# EAGLE design rf_spectrum (EAGLE 8.2.0)
AUTHOR: Joshua Adkins; REV: A; TITLE: RF Spectrum Module

## Sheet 1 of 2: MCU, powersupply, module header
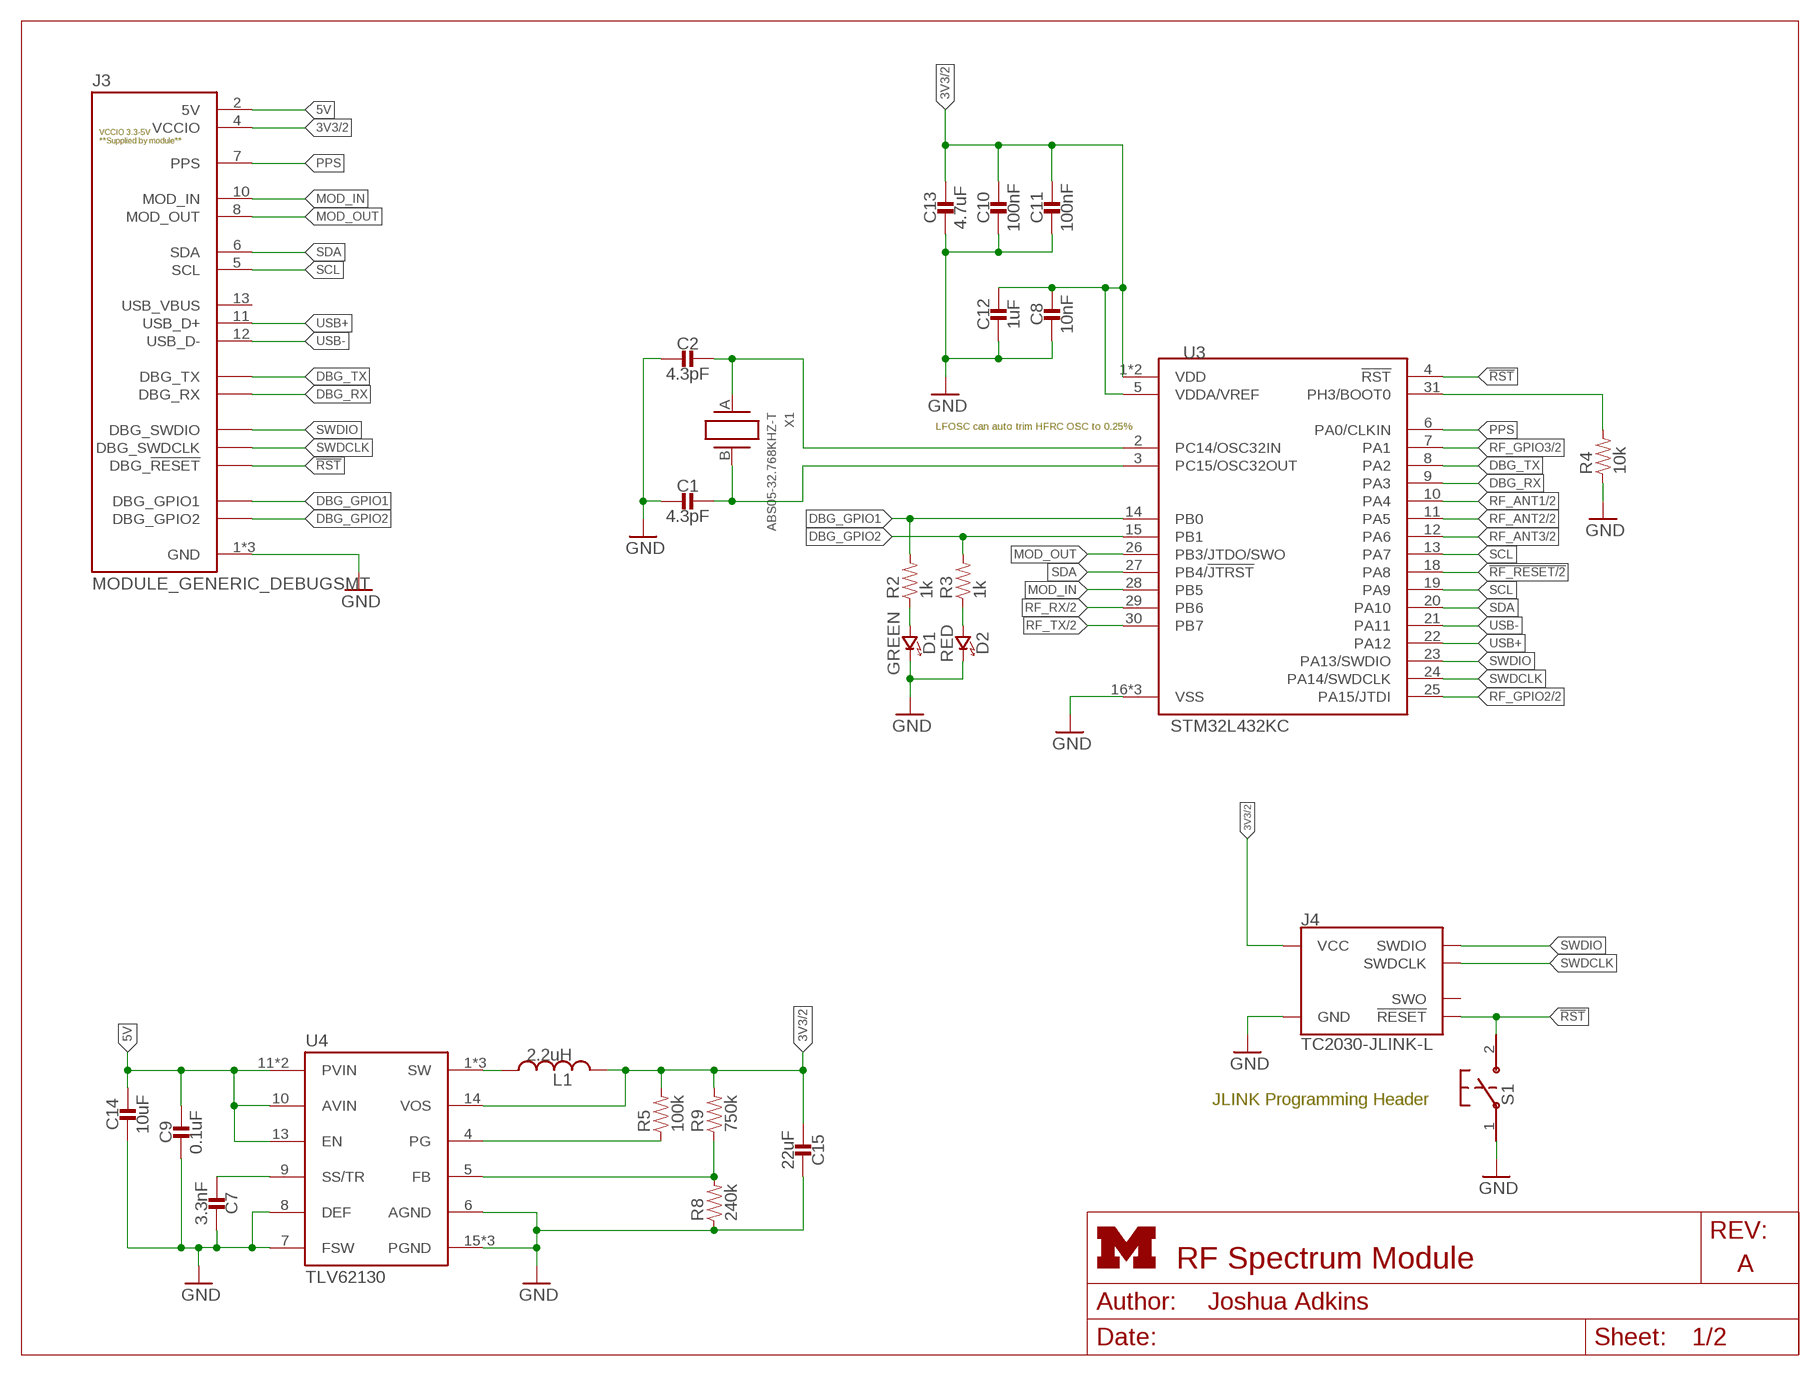
[diagram p0: schematic, sheet 1]
FRAME1 (LETTER_L_UMICH): HEIGHT: 8.5in; WIDTH: 11in

### Parts
C1  4.3pF  CAPACITOR0402_CAP  [0402_CAP]
C2  4.3pF  CAPACITOR0402_CAP  [0402_CAP]
C7  3.3nF  CAPACITOR0603_CAP  [0603_CAP]
C8  10nF  CAPACITOR0402_CAP  [0402_CAP]
C9  0.1uF  CAPACITOR0603_CAP  [0603_CAP]
C10  100nF  CAPACITOR0402_CAP  [0402_CAP]
C11  100nF  CAPACITOR0402_CAP  [0402_CAP]
C12  1uF  CAPACITOR0402_CAP  [0402_CAP]
C13  4.7uF  CAPACITOR0402_CAP  [0402_CAP]
C14  10uF  CAPACITOR0603_CAP  [0603_CAP]
C15  22uF  CAPACITOR0603_CAP  [0603_CAP]
D1  GREEN  LED0603  [LED-0603]
D2  RED  LED0603  [LED-0603]
J3  MODULE_GENERIC_DEBUGSMT  [MODULE_GENERIC_DEBUG_SMT]
J4  TC2030-JLINK-L  [TC2030-IDC]
L1  2.2uH  INDUCTORIHL  [IHL-1212BZ-11]
R2  1k  RESISTOR0402_RES  [0402_RES]
R3  1k  RESISTOR0402_RES  [0402_RES]
R4  10k  RESISTOR0402_RES  [0402_RES]
R5  100k  RESISTOR0603_RES  [0603-RES]
R8  240k  RESISTOR0603_RES  [0603-RES]
R9  750k  RESISTOR0603_RES  [0603-RES]
S1  B3U-1000P  [B3U-1000P]
U3  STM32L432KC  [UQFN-32]
U4  TLV62130  [TQFN-16/3MM]
X1  ABS05-32.768KHZ-T  [ABS05]

### Nets
3V3: C8.1 C10.1 C11.1 C12.1 C13.1 C15.2 J3.4(VCCIO) J4.1(VCC) L1.P$2 R5.2 R9.2 U3.1(VDD) U3.5(VDDA/VREF) U3.17(VDD) U4.14(VOS) ; also sheet 2
3VSWOUT: L1.P$1 U4.1(SW) U4.2(SW) U4.3(SW)
5V: C9.1 C14.1 J3.2(5V) U4.10(AVIN) U4.11(PVIN) U4.12(PVIN) U4.13(EN)
!RF_RESET: U3.18(PA8) ; also sheet 2
!RST: J3.20(DBG_!RESET) J4.3(!RESET) S1.2 U3.4(!RST)
DBG_GPIO1: J3.16(DBG_GPIO1) R2.2 U3.14(PB0)
DBG_GPIO2: J3.19(DBG_GPIO2) R3.2 U3.15(PB1)
DBG_RX: J3.18(DBG_RX) U3.9(PA3)
DBG_TX: J3.17(DBG_TX) U3.8(PA2)
GND: C1.2 C2.2 C7.1 C8.2 C9.2 C10.2 C11.2 C12.2 C13.2 C14.2 C15.1 D1.C(CATHODE) D2.C(CATHODE) J3.1(GND) J3.14(GND) J3.15(GND) J4.5(GND) R4.1 R8.1 S1.1 U3.16(VSS) U3.32(VSS) U3.THERMAL(VSS) U4.6(AGND) U4.7(FSW) U4.8(DEF) U4.15(PGND) U4.16(PGND) U4.GND ; also sheet 2
MOD_IN: J3.10(MOD_IN) U3.28(PB5)
MOD_OUT: J3.8(MOD_OUT) U3.26(PB3/JTDO/SWO)
N$9: C2.1 U3.2(PC14/OSC32IN) X1.A
N$10: C1.1 U3.3(PC15/OSC32OUT) X1.B
N$11: R4.2 U3.31(PH3/BOOT0)
N$12: D1.A(ANODE) R2.1
N$34: C7.2 U4.9(SS/TR)
N$36: R5.1 U4.4(PG)
N$37: R8.2 R9.1 U4.5(FB)
PPS: J3.7(PPS) U3.6(PA0/CLKIN)
R3: D2.A(ANODE) R3.1
RF_ANT1: U3.10(PA4) ; also sheet 2
RF_ANT2: U3.11(PA5) ; also sheet 2
RF_ANT3: U3.12(PA6) ; also sheet 2
RF_GPIO2: U3.25(PA15/JTDI) ; also sheet 2
RF_GPIO3: U3.7(PA1) ; also sheet 2
RF_RX: U3.29(PB6) ; also sheet 2
RF_TX: U3.30(PB7) ; also sheet 2
SCL: J3.5(SCL) U3.13(PA7) U3.19(PA9)
SDA: J3.6(SDA) U3.20(PA10) U3.27(PB4/!JTRST)
SWDCLK: J3.21(DBG_SWDCLK) J4.4(SWDCLK) U3.24(PA14/SWDCLK)
SWDIO: J3.22(DBG_SWDIO) J4.2(SWDIO) U3.23(PA13/SWDIO)
USB+: J3.11(USB_D+) U3.22(PA12)
USB-: J3.12(USB_D-) U3.21(PA11)
Unconnected: J3.13(USB_VBUS) J4.6(SWO)

### Notes on the sheet
- LFOSC can auto trim HFRC OSC to 0.25%
- JLINK Programming Header

## Sheet 2 of 2: RF spectrum and switch
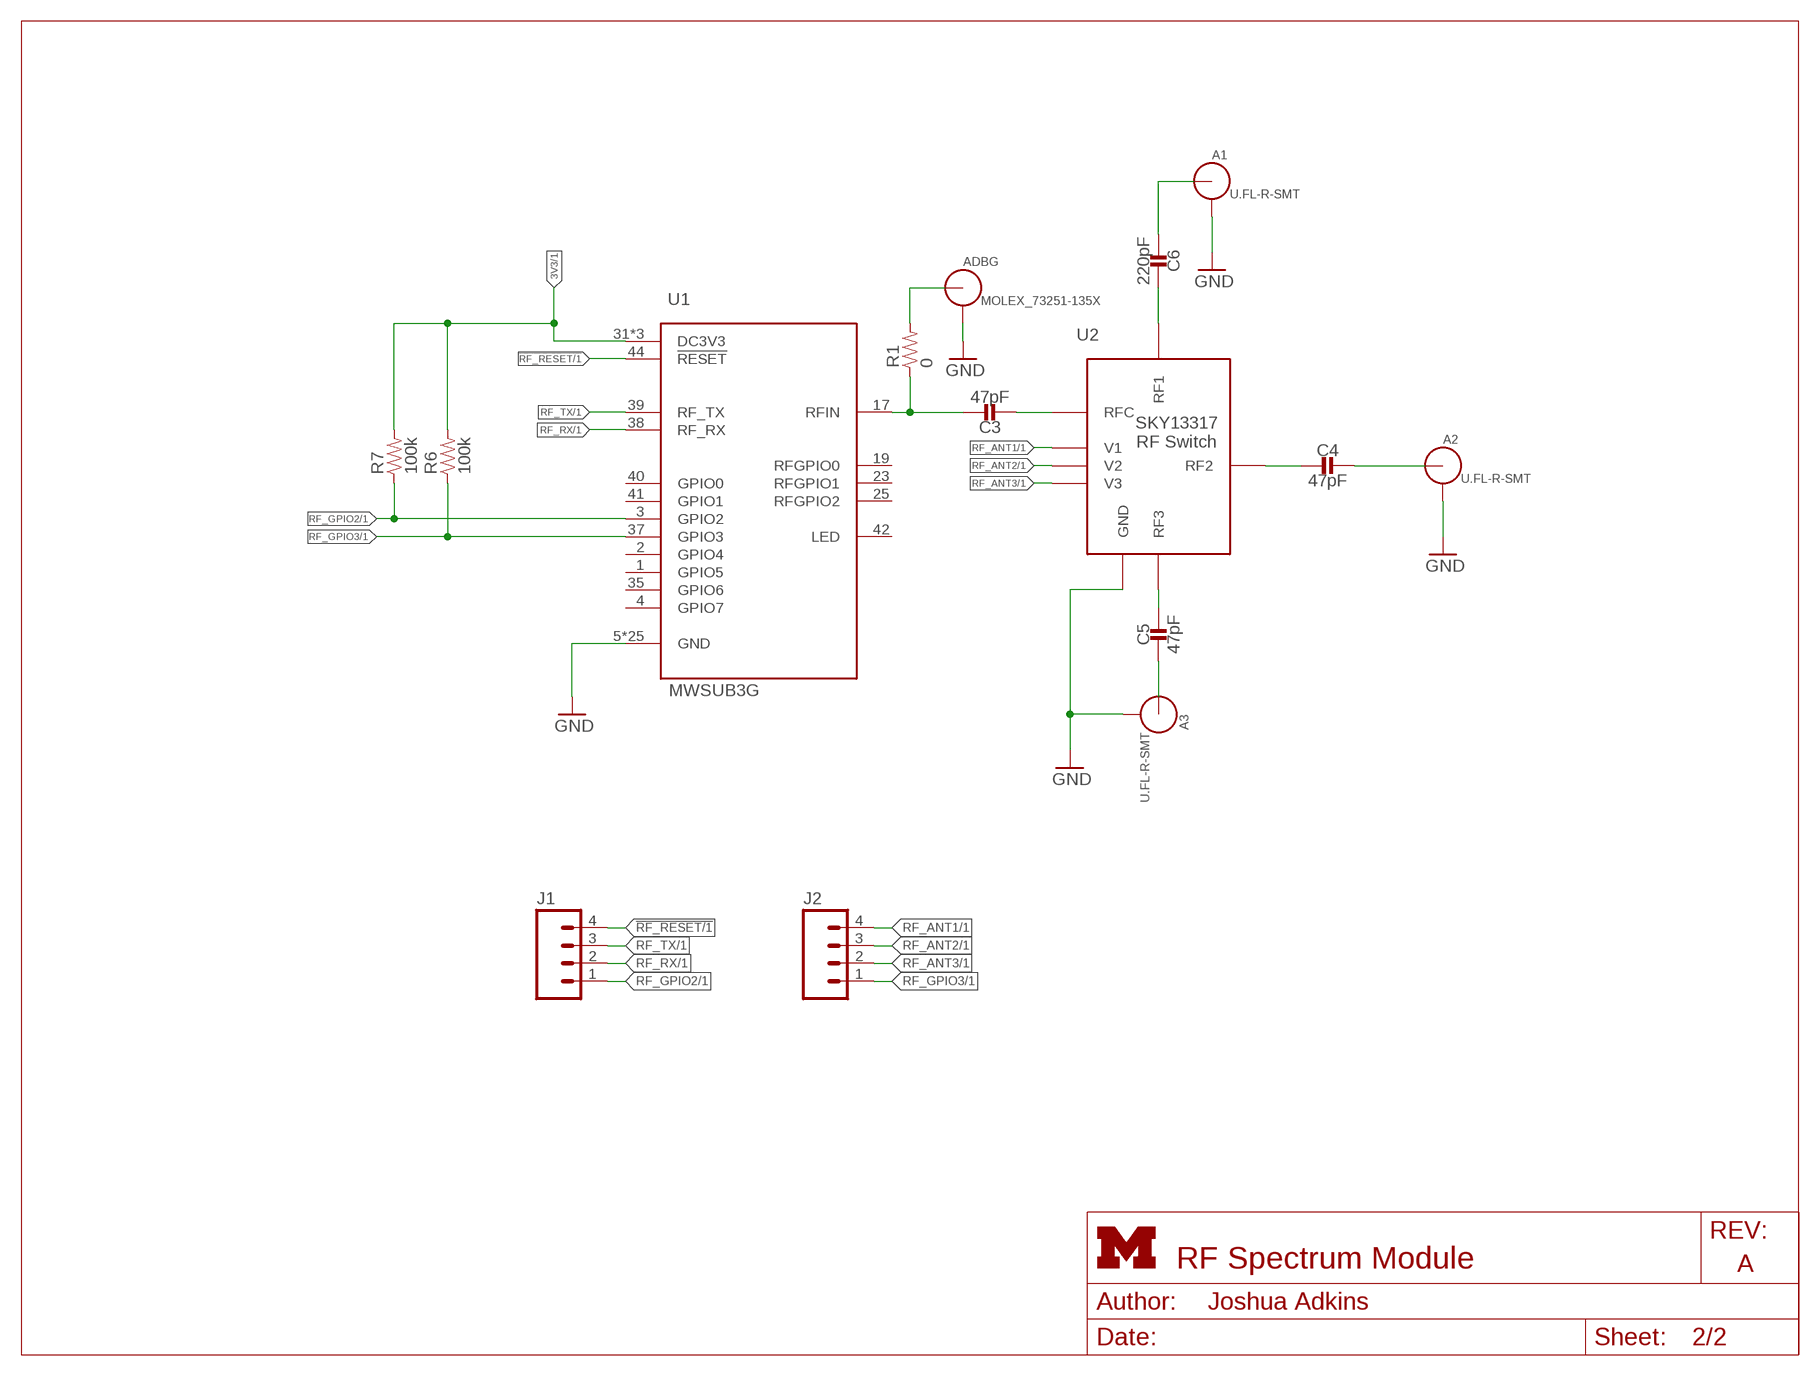
[diagram p1: schematic, sheet 2]
FRAME2 (LETTER_L_UMICH): HEIGHT: 8.5in; WIDTH: 11in

### Parts
A1  U.FL-R-SMT  [U.FL_SMT]
A2  U.FL-R-SMT  [U.FL_SMT]
A3  U.FL-R-SMT  [U.FL_SMT]
ADBG  MOLEX_73251-135X  [SMA-J/PCB]
C3  47pF  CAPACITOR0402_CAP  [0402_CAP]
C4  47pF  CAPACITOR0402_CAP  [0402_CAP]
C5  47pF  CAPACITOR0402_CAP  [0402_CAP]
C6  220pF  CAPACITOR0402_CAP  [0402_CAP]
J1  M04PTH  [1X04]
J2  M04PTH  [1X04]
R1  0  RESISTOR0402_RES  [0402_RES]
R6  100k  RESISTOR0402_RES  [0402_RES]
R7  100k  RESISTOR0402_RES  [0402_RES]
U1  MWSUB3G  [MWSUB3G]
U2  SKY13317  [XDFN-8]

### Nets
3V3: R6.2 R7.2 U1.31(DC3V3) U1.32(DC3V3) U1.33(DC3V3) ; also sheet 1
!RF_RESET: J1.4 U1.44(!RESET) ; also sheet 1
GND: A1.GND1 A1.GND2 A2.GND1 A2.GND2 A3.GND1 A3.GND2 ADBG.2 ADBG.3 ADBG.4 ADBG.5 U1.5(GND) U1.6(GND) U1.7(GND) U1.8(GND) U1.9(GND) U1.10(GND) U1.11(GND) U1.12(GND) U1.13(GND) U1.14(GND) U1.15(GND) U1.16(GND) U1.18(GND) U1.20(GND) U1.21(GND) U1.22(GND) U1.24(GND) U1.26(GND) U1.27(GND) U1.28(GND) U1.29(GND) U1.34(GND) U1.43(GND) U1.45(GND) U1.46(GND) U2.P$1(GND) ; also sheet 1
N$1: C3.1 R1.1 U1.17(RFIN)
N$2: C3.2 U2.1(RFC)
N$3: C6.1 U2.4(RF1)
N$4: A1.SIG(ANT) C6.2
N$5: C4.2 U2.5(RF2)
N$6: A2.SIG(ANT) C4.1
N$7: C5.1 U2.8(RF3)
N$8: A3.SIG(ANT) C5.2
N$14: ADBG.1(ANT) R1.2
RF_ANT1: J2.4 U2.3(V1) ; also sheet 1
RF_ANT2: J2.3 U2.6(V2) ; also sheet 1
RF_ANT3: J2.2 U2.7(V3) ; also sheet 1
RF_GPIO2: J1.1 R7.1 U1.3(GPIO2) ; also sheet 1
RF_GPIO3: J2.1 R6.1 U1.37(GPIO3) ; also sheet 1
RF_RX: J1.2 U1.38(RF_RX) ; also sheet 1
RF_TX: J1.3 U1.39(RF_TX) ; also sheet 1
Unconnected: U1.1(GPIO5) U1.2(GPIO4) U1.4(GPIO7) U1.19(RFGPIO0) U1.23(RFGPIO1) U1.25(RFGPIO2) U1.35(GPIO6) U1.40(GPIO0) U1.41(GPIO1) U1.42(LED)

## Library data of the parts
A1-A3 = connector:U.FL-R-SMT: U.FL-R-SMT Antenna Connector; DIGIKEY: H122041-ND
ADBG = connector:MOLEX_73251-135X: SMA JACK SMT 50 OHM; DIGIKEY: WM9357-ND
C1 C2 = passives:CAPACITOR: 0402 Capacitor; DIGIKEY: 490-6243-1-ND; MF: Murata; MFN: GRM1555C1H4R3BA01D
C3-C5 = passives:CAPACITOR: 0402 Capacitor; DIGIKEY: 490-6241-1-ND; MF: Murata; MFN: GRM1555C1H470FA01D
C6 = passives:CAPACITOR: 0402 Capacitor; DIGIKEY: 490-1293-1-ND; MF: Murata; MFN: GRM1555C1H221JA01D
C7 = passives:CAPACITOR: 0402 Capacitor; DIGIKEY: 490-1503-1-ND; MF: Murata; MFN: GRM188R71H332KA01D
C8 = passives:CAPACITOR: 0402 Capacitor; DIGIKEY: 490-4516-1-ND; MF: Murata; MFN: GRM155R71H103KA88D
C9 = passives:CAPACITOR: 0402 Capacitor; DIGIKEY: 490-1532-1-ND; MF: Murata; MFN: GRM188R71C104KA01D
C10 C11 = passives:CAPACITOR: 0402 Capacitor; DIGIKEY: 490-6328-1-ND; MF: Murata; MFN: GRM155R71C104KA88J
C12 = passives:CAPACITOR: 0402 Capacitor; DIGIKEY: 490-1320-1-ND; MF: Murata; MFN: GRM155R60J105KE19D
C13 = passives:CAPACITOR: 0402 Capacitor; DIGIKEY: 490-5915-1-ND; MF: Murata; MFN: GRM155R60J475ME47D
C14 = passives:CAPACITOR: 0402 Capacitor; DIGIKEY: 490-6405-1-ND; MF: Murata; MFN: GRM188R60J106ME47J
C15 = passives:CAPACITOR: 0402 Capacitor; DIGIKEY: 490-7611-1-ND; MF: Murata; MFN: GRM188R60J226MEA0D
D1 = leds:LED: LED; DIGIKEY: 160-1446-1-ND; MF: Lite-ON; MFN: LTST-C191KGKT
D2 = leds:LED: LED; DIGIKEY: 160-1447-1-ND; MF: Lite-On; MFN: LTST-C191KRKT
J1 J2 = SparkFun-Connectors:M04: Header 4 Standard 4-pin 0.1" header. Use with straight break away headers (SKU : PRT-00116), right angle break away headers (PRT-00553), swiss pins (PRT-00743), machine pins (PRT-00117), and female headers (PRT-00115). Molex polarized connector foot print use with SKU : PRT-08231 with associated crimp pins and housings. 1MM SMD Version SKU: PRT-10208; DIGIKEY: WM8086-ND; MF: Molex; MFN: 0901200764
J3 = signpost:MODULE_GENERIC_DEBUG: The debug version of the signpost module header; DIGIKEY1: S9170-ND; DIGIKEY2: WM17450-ND; MF1: Sullins; MF2: Molex; MFN1: SBH11-PBPC-D07-ST-BK; MFN2: 0015912080
J4 = connector:TC2030-JLINK
L1 = passives:INDUCTOR: A very specific inductor; DIGIKEY: 541-1322-1-ND
R1 = passives:RESISTOR: Resistor Basic schematic elements and footprints for 0603, 1206, and PTH resistors.; DIGIKEY: 311-0.0JRCT-ND; MF: Yageo; MFN: RC0402JR-070RL
R2-R4 = passives:RESISTOR: Resistor Basic schematic elements and footprints for 0603, 1206, and PTH resistors.; DIGIKEY: 311-1.0KJRCT-ND; MF: Yageo; MFN: RC0402JR-071KL
R5 = passives:RESISTOR: Resistor Basic schematic elements and footprints for 0603, 1206, and PTH resistors.; DIGIKEY: 311-100KGRCT-ND; MF: Yageo; MFN: RC0603JR-07100KL
R6 R7 = passives:RESISTOR: Resistor Basic schematic elements and footprints for 0603, 1206, and PTH resistors.; DIGIKEY: 311-100KLRCT-ND; MF: Yageo; MFN: RC0402FR-07100KL
R8 = passives:RESISTOR: Resistor Basic schematic elements and footprints for 0603, 1206, and PTH resistors.; DIGIKEY: 311-240KGRCT-ND; MF: Yageo; MFN: RC0603JR-07240KL
R9 = passives:RESISTOR: Resistor Basic schematic elements and footprints for 0603, 1206, and PTH resistors.; DIGIKEY: 311-750KGRCT-ND; MF: Yageo; MFN: 311-750KGRCT-ND
S1 = switches:B3U: Switch; DIGIKEY: SW1020CT-ND
U1 = signpost:MWSUB3G: An RF Spectrum analyzer module; MF: RFExplorer; MFN: MWSUB3G
U2 = chips:SKY13317: 20-6000 MHZ SP3T RF Switch
U3 = chips:STM32L432KC: Simple STM32 Cortex M4. Features include a fast 32bit timer, 2 spi, 2 i2c, 2usart, hardware aes and more.; DIGIKEY: 497-16578-ND; MF: STM; MFN: STM32L432KCU6
U4 = chips:TLV62130: High Efficient 3A switching step-down regulator. 1V-5V out, 4V-17V in.; DIGIKEY: 296-35978-1-ND
X1 = crystals:ABS05-32.768KHZ: 32.768kHz Crystal; DIGIKEY: 535-11899-1-ND

## Board
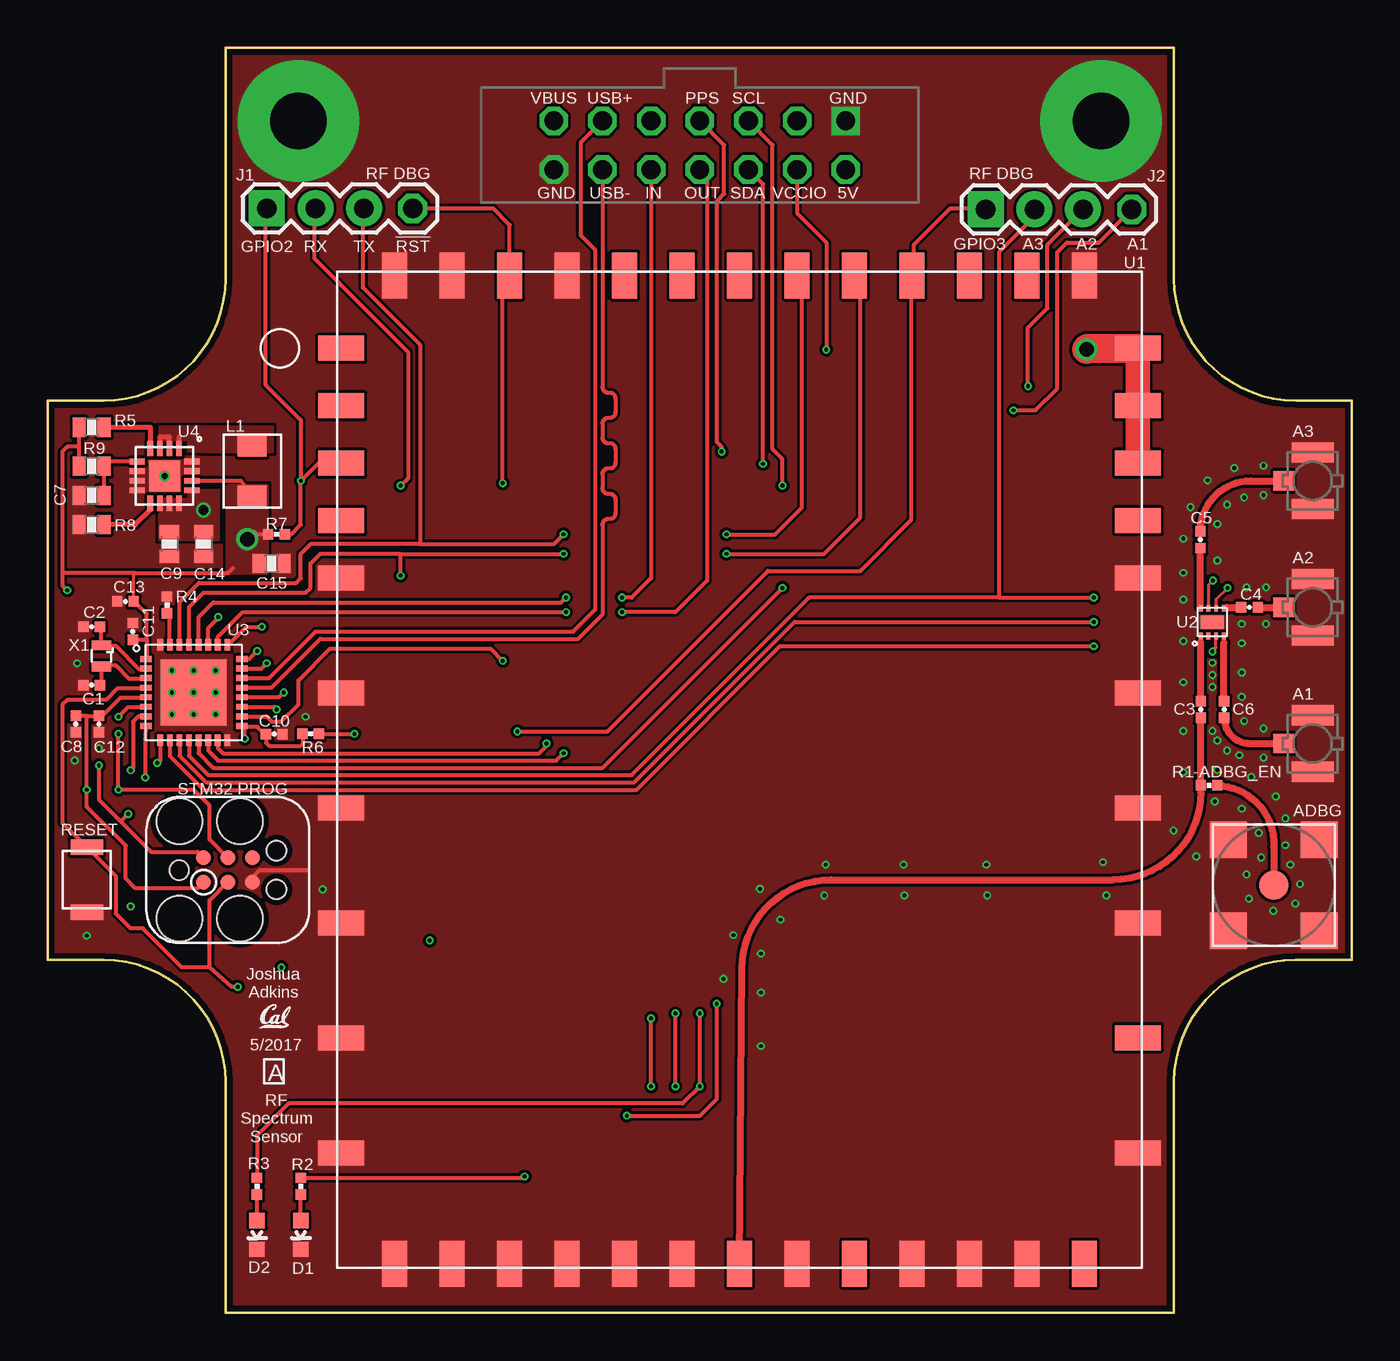
[diagram p2: board, top side]
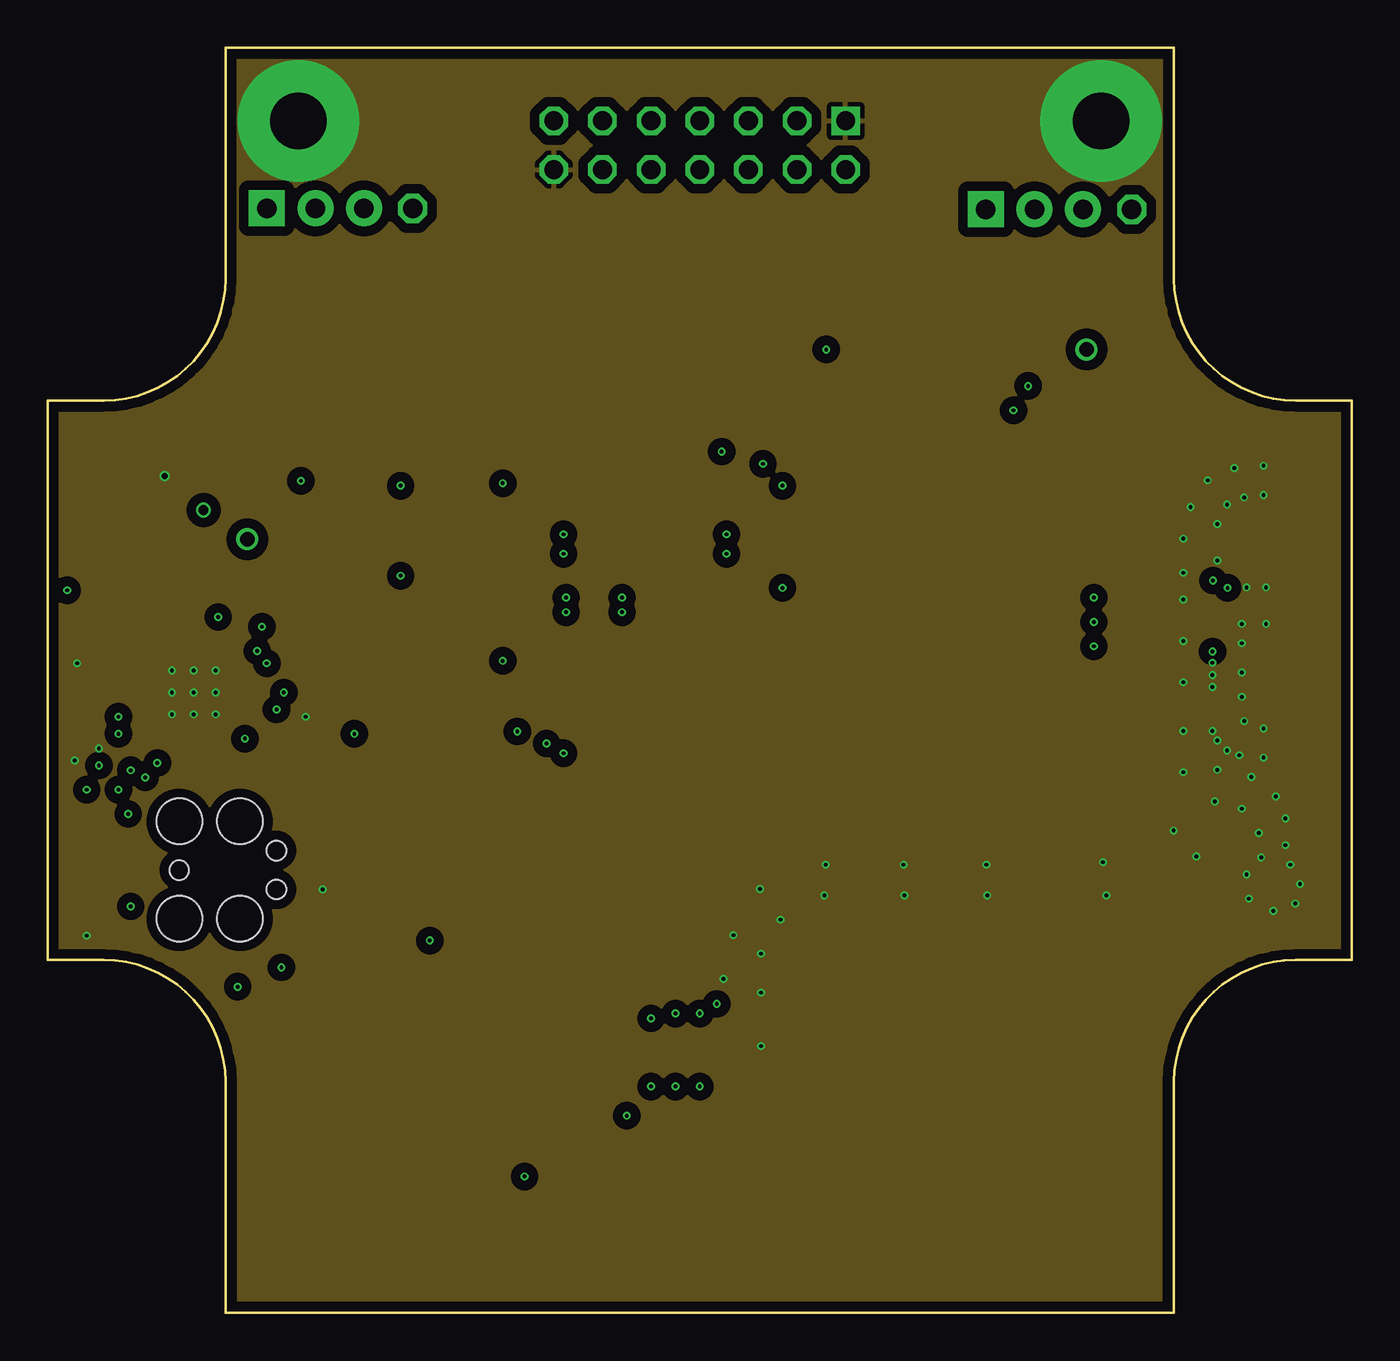
[diagram p3: board, inner layer Route2]
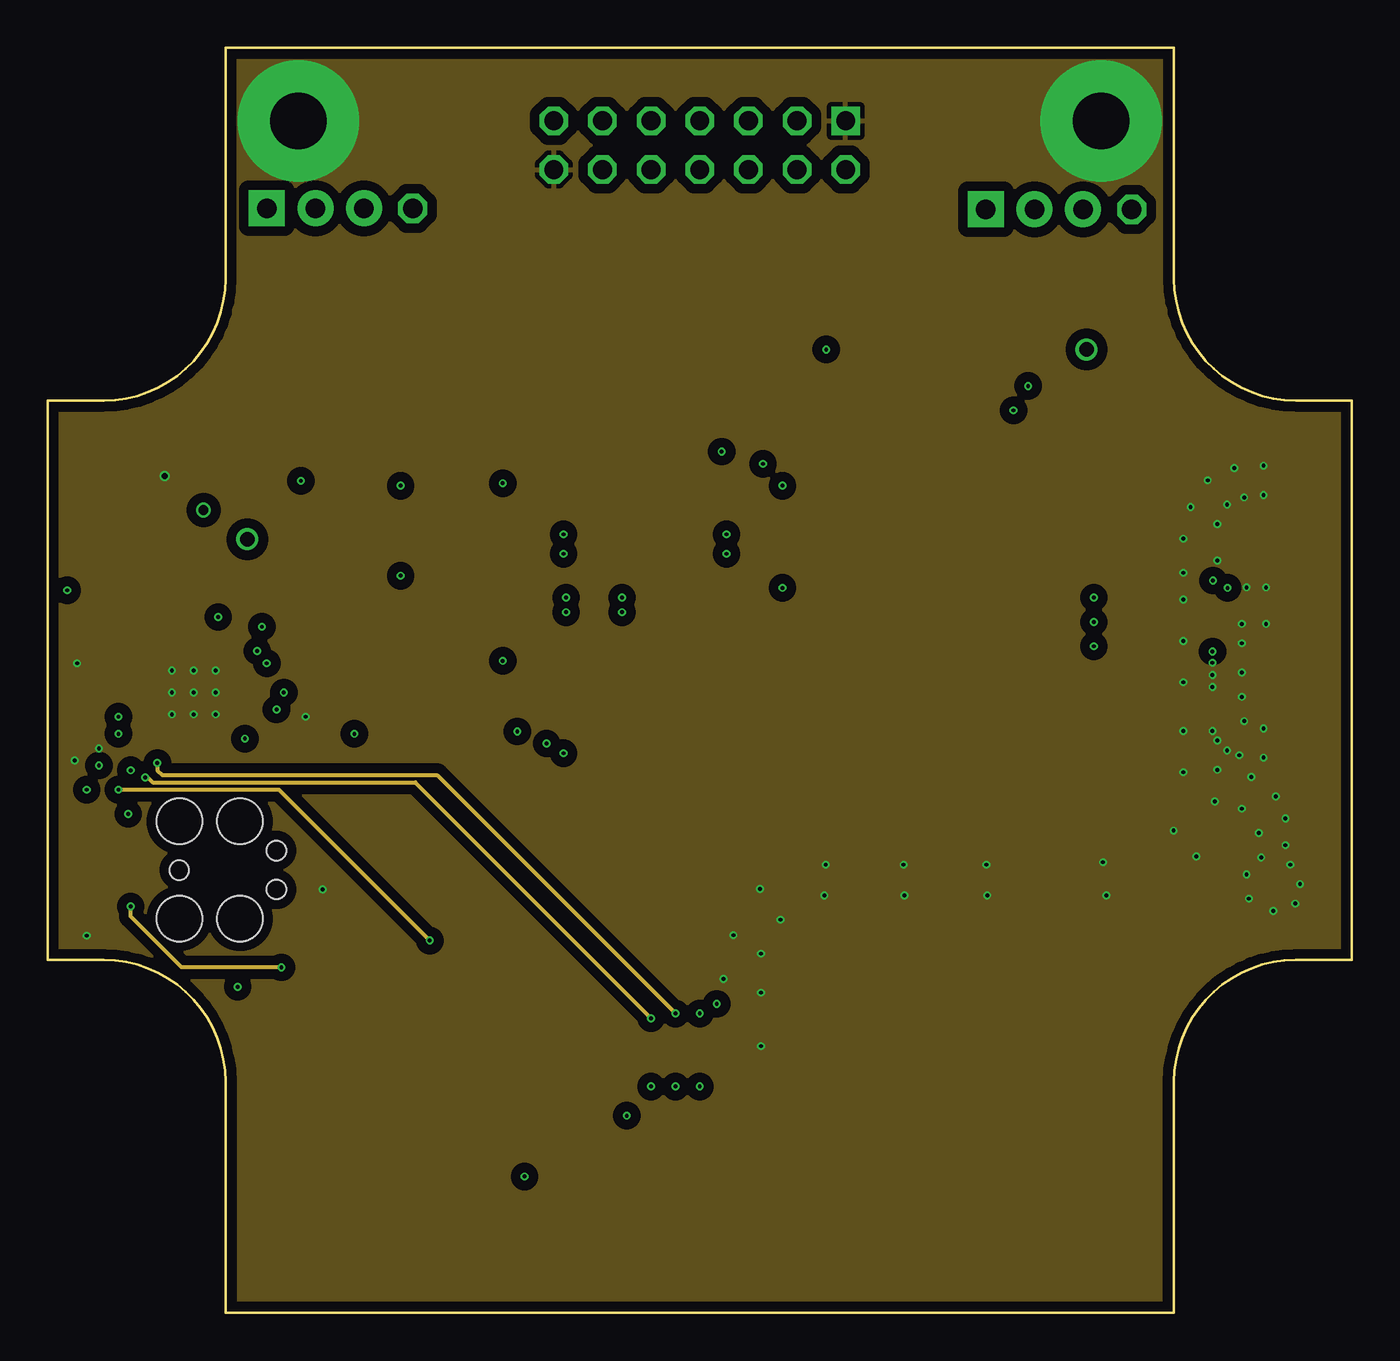
[diagram p4: board, inner layer Route15]
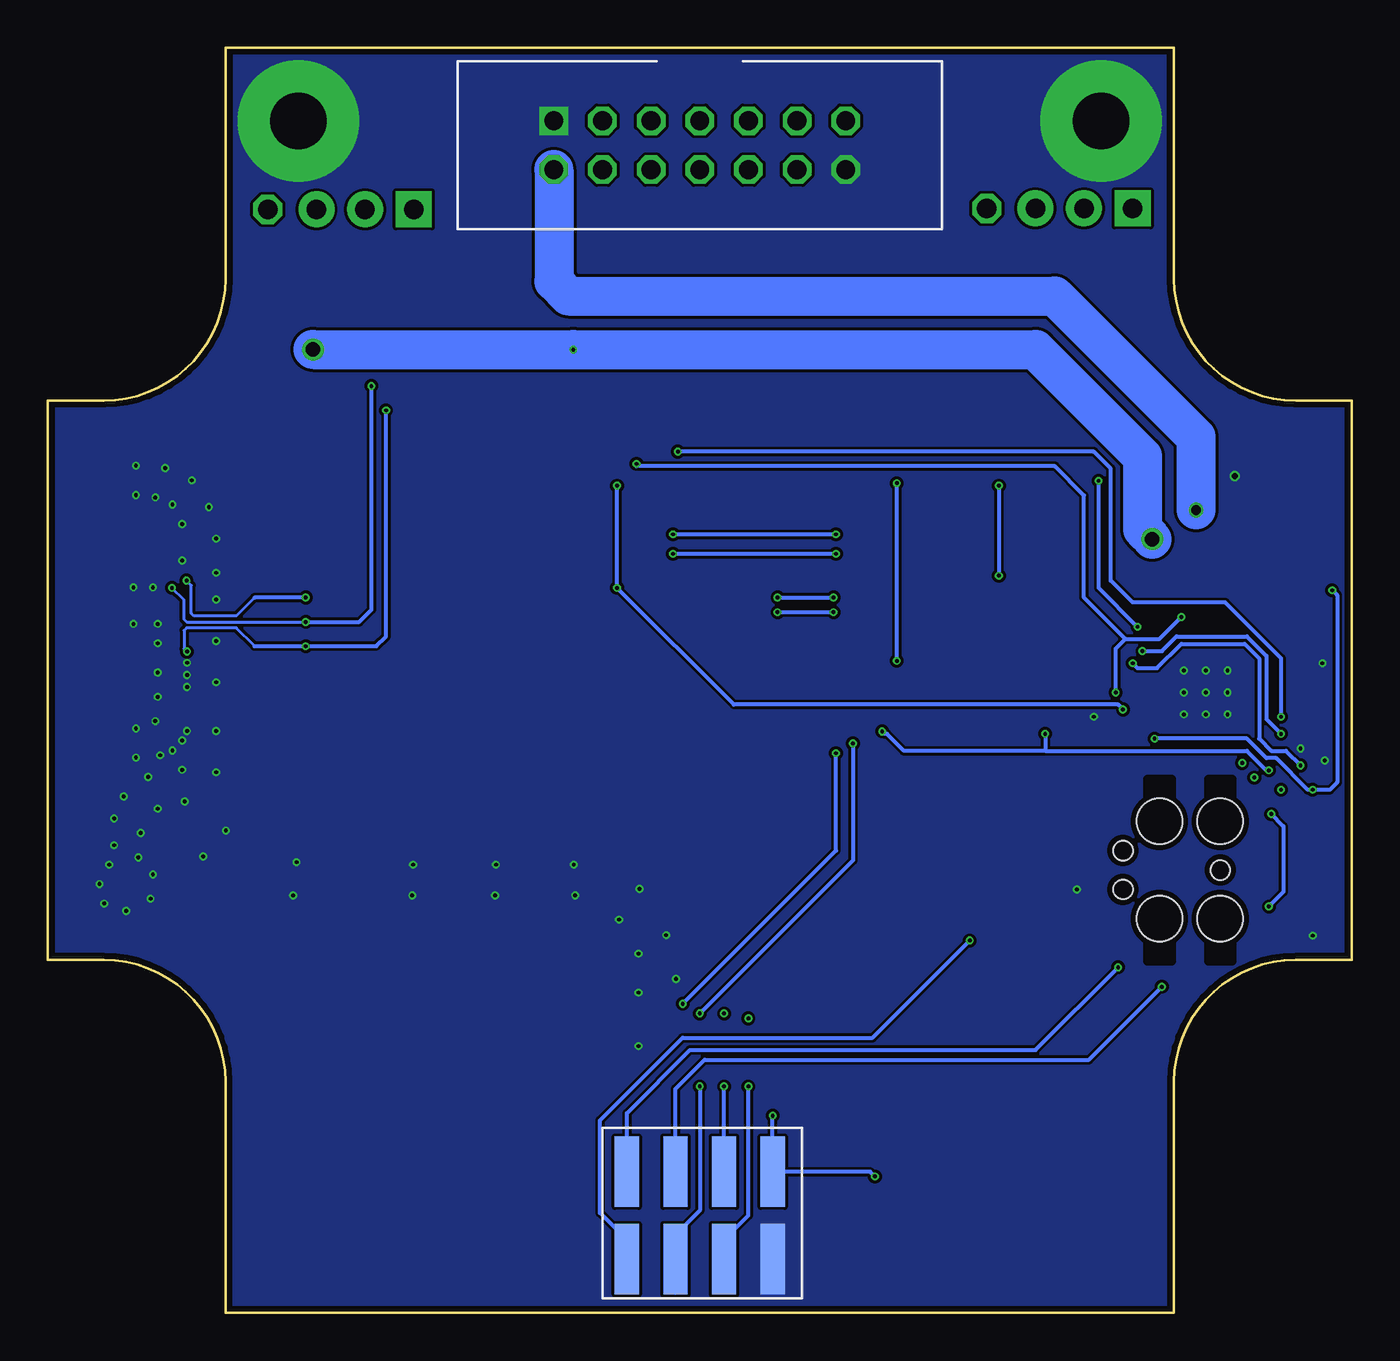
[diagram p5: board, bottom side, seen from below]

Size 68.07 x 66.04 mm. Coordinates in mm from the lower left corner, seen from the top.
Outline: 9.27,66.04 58.8,66.04 58.8,53.98 arc90 65.15,47.62 68.07,47.62 68.07,18.41 65.15,18.41 arc90 58.8,12.07 58.8,0 9.27,0 9.27,12.07 arc90 2.92,18.41 0,18.41 0,47.62 2.92,47.62 arc90 9.27,53.98 9.27,66.04
Copper layers (1+2*15+16): Top 0.0178mm / dielectric 59mil / Route2 0.0356mm / dielectric 0.1499mm / Route15 0.0356mm / dielectric 0.2007mm / Bottom 0.0178mm
Design rules "quickturn_co_kr_1oz_4lyr *": minimum track width 6mil, minimum drill 8mil, track to track 6mil, track to pad 6mil, pad to pad 6mil, via to via 6mil, smd to smd 6mil, copper to edge 12mil, drill to drill 12mil, minimum pad ring 8mil, minimum via ring 4mil, stop-mask expansion 3mil, vias tented up to drill 50mil, thermal gap 10mil

### Footprints (pad centres in the part's own frame; a part is rotated, then mirrored left to right if it is on the bottom)
U.FL_SMT = smd 1.05 x 2.2: GND1 -1.475,0; GND2 1.475,0 | smd 1 x 1.05: SIG 0,-1.525
SMA-J/PCB = smd 1.52 x 1.52: 1 0,0 | smd 1.91 x 1.91: 2 -2.375,-2.375; 3 2.375,-2.375; 4 2.375,2.375; 5 -2.375,2.375
0402_CAP = smd 0.536 x 0.546: 1 -0.433,0; 2 0.433,0
0603_CAP = smd 0.7 x 1: 1 -0.65,0; 2 0.65,0
LED-0603 = smd 0.8 x 0.8: A 0,-0.75; C 0,0.75
1X04 = drill 1.016 pad 1.88 square: 1 0,0 | drill 1.016 pad 1.88: 2 2.54,0; 3 5.08,0 | drill 1.016 pad 1.524 octagon: 4 7.62,0
MODULE_GENERIC_DEBUG_SMT = drill 0.991 square: 1 7.62,29.21 | drill 0.991 octagon: 2 7.62,26.67; 3 5.08,29.21; 4 5.08,26.67; 5 2.54,29.21; 6 2.54,26.67; 7 0,29.21; 8 0,26.67; 9 -2.54,29.21; 10 -2.54,26.67; 11 -5.08,29.21; 12 -5.08,26.67; 13 -7.62,29.21; 14 -7.62,26.67 | smd 1.27 x 3.683 bottom: 15 -3.81,-30.226; 16 -3.81,-25.654; 17 -1.27,-30.226; 18 -1.27,-25.654; 19 1.27,-30.226; 20 1.27,-25.654; 21 3.81,-30.226; 22 3.81,-25.654
TC2030-IDC = smd 0.787 x 0.787: 1 -1.27,-0.635; 2 -1.27,0.635; 3 0,-0.635; 4 0,0.635; 5 1.27,-0.635; 6 1.27,0.635 | hole 2.375: -2.54,2.54; 0.635,2.54; 0.635,-2.54; -2.54,-2.54 | hole 1.016: -2.54,0; 2.54,1.016; 2.54,-1.016
IHL-1212BZ-11 = smd 1.2 x 1.5: P$1 -1.35,0; P$2 1.35,0
0402_RES = smd 0.536 x 0.546: 1 -0.433,0; 2 0.433,0
0603-RES = smd 0.7 x 1: 1 -0.65,0; 2 0.65,0
B3U-1000P = smd 0.8 x 1.7: 1 -1.7,0; 2 1.7,0
MWSUB3G = smd 1.3 x 2.4: 1 4,0.2; 2 7,0.2; 3 10,0.2; 4 13,0.2; 5 16,0.2; 6 22,0.2; 7 28,0.2; 8 34,0.2; 9 40,0.2; 10 46,0.2; 24 46,41.8; 25 40,41.8; 26 34,41.8; 27 28,41.8; 28 22,41.8; 29 16,41.8; 30 13,41.8; 31 10,41.8; 32 7,41.8; 33 4,41.8 | smd 2.4 x 1.3: 11 51.8,3; 12 51.8,6; 13 51.8,9; 14 51.8,12; 15 51.8,15; 16 51.8,18; 17 51.8,21; 18 51.8,24; 19 51.8,27; 20 51.8,30; 21 51.8,33; 22 51.8,36; 23 51.8,39; 34 0.2,39; 35 0.2,36; 36 0.2,33; 37 0.2,30; 38 0.2,27; 39 0.2,24; 40 0.2,21; 41 0.2,18; 42 0.2,15; 43 0.2,12; 44 0.2,9; 45 0.2,6; 46 0.2,3
XDFN-8 = smd 0.35 x 0.2: 1 0.025,1.35; 2 0.025,0.95; 3 0.025,0.55; 4 0.025,0.15; 5 1.475,0.15; 6 1.475,0.55; 7 1.475,0.95; 8 1.475,1.35 | smd 0.7 x 1.2: P$1 0.75,0.75
UQFN-32 = smd 0.6 x 0.3: 1 -2.5,1.75; 2 -2.5,1.25; 3 -2.5,0.75; 4 -2.5,0.25; 5 -2.5,-0.25; 6 -2.5,-0.75; 7 -2.5,-1.25; 8 -2.5,-1.75; 17 2.5,-1.75; 18 2.5,-1.25; 19 2.5,-0.75; 20 2.5,-0.25; 21 2.5,0.25; 22 2.5,0.75; 23 2.5,1.25; 24 2.5,1.75 | smd 0.3 x 0.6: 9 -1.75,-2.5; 10 -1.25,-2.5; 11 -0.75,-2.5; 12 -0.25,-2.5; 13 0.25,-2.5; 14 0.75,-2.5; 15 1.25,-2.5; 16 1.75,-2.5; 25 1.75,2.5; 26 1.25,2.5; 27 0.75,2.5; 28 0.25,2.5; 29 -0.25,2.5; 30 -0.75,2.5; 31 -1.25,2.5; 32 -1.75,2.5 | smd 3.45 x 3.45: THERMAL 0,0
TQFN-16/3MM = smd 0.3 x 0.8: 1 -0.75,-1.43; 2 -0.25,-1.43; 3 0.25,-1.43; 4 0.75,-1.43; 9 0.75,1.43; 10 0.25,1.43; 11 -0.25,1.43; 12 -0.75,1.43 | smd 0.8 x 0.3: 5 1.43,-0.75; 6 1.43,-0.25; 7 1.43,0.25; 8 1.43,0.75; 13 -1.43,0.75; 14 -1.43,0.25; 15 -1.43,-0.25; 16 -1.43,-0.75 | smd 1.63 x 1.63: GND 0,0
ABS05 = smd 0.5 x 1: A -0.55,0; B 0.55,0

### Placement (x,y rotation side)
A1  66.04,29.72 270 top
A2  66.04,36.83 270 top
A3  66.04,43.43 270 top
ADBG  64.01,22.33 0 top
C1  2.29,32.77 180 top
C2  2.29,35.81 180 top
C3  60.2,31.5 90 top
C4  62.74,36.83 180 top
C5  60.17,40.36 90 top
C6  61.42,31.5 270 top
C7  2.29,41.15 0 top
C8  1.46,30.73 270 top
C9  6.35,40.13 270 top
C10  11.82,30.21 0 top
C11  4.43,35.57 90 top
C12  2.67,30.73 270 top
C13  4.05,37.14 180 top
C14  8.13,40.13 270 top
C15  11.68,39.12 180 top
D1  13.21,4.06 180 top
D2  10.92,4.06 180 top
J1  11.43,57.66 0 top
J2  48.97,57.61 0 top
J3  34.04,33.02 0 top
J4  9.4,23.11 0 top
L1  10.67,43.94 270 top
R1  60.63,27.53 0 top
R2  13.21,6.6 90 top
R3  10.92,6.6 90 top
R4  6.22,36.96 270 top
R5  2.29,46.23 180 top
R6  13.72,30.23 180 top
R7  11.94,40.64 180 top
R8  2.29,42.67 0 top
R9  2.29,44.2 180 top
S1  2.03,22.61 90 top
U1  15.11,54.36 270 top
U2  61.54,35.31 90 top
U3  7.62,32.38 0 top
U4  6.1,43.69 180 top
U$2  [UCB_CAL_50MIL]  11.05,14.84 0 top
X1  2.79,34.29 270 top

### Tracks (layer width: path | path; a pad name or v marks a point on that pad's centre or on a via)
3V3  (via drill 0.2, 0.76)
  Top 0.152: C13.1 4.48,38.52 4.57,38.61
  Top 0.203: 5.17,35.14 5.17,36.49 5.08,36.58 C13.1 | 5.17,35.14 5.17,34.12 U3.1 | C11.1 5.17,35.14 | 2.03,31.17 C8.1 | 2.03,31.17 C12.1 2.79,31.12 3.79,32.11 5.1,32.11 U3.5 | U4.14 10.08,43.44 L1.P$2 | R9.2 1.64,45.21 | 1.64,45.21 R5.2 | 2.03,31.17 v2.03,27.3 2.03,26.42 4.06,24.38 4.06,22.67 4.57,22.16 7.81,22.16 J4.1 | 1.64,45.21 1.02,45.21 0.76,44.96 0.76,38.61 | 0.76,38.61 0.76,37.97 v1.02,37.72 | 0.76,38.61 4.57,38.61 9.4,38.61 9.65,38.86 | v10.29,29.97 10.29,30.48 U3.17 10.16,30.59 10.93,30.59 11.3,30.23 C10.1 11.39,29.76 11.56,29.59 13.21,29.59 13.34,29.72 13.34,30.06 R6.2 | J3.4 39.12,57.4 40.64,55.88 v40.64,50.29 40.64,50.16 | R7.2 10.92,40.64 10.8,40.77
  Top 0.254: U4.14
  Top 1.27: U1.31 U1.32 U1.33
  Top 1.524: U1.33 54.29,50.36 v54.23,50.29
  Bottom 0.203: v1.02,37.72 0.76,37.47 0.76,27.69 1.14,27.3 v2.03,27.3 2.29,27.3 3.94,28.96 4.45,28.96 5.46,29.97 v10.29,29.97
  Bottom 2.032: v54.23,50.29 v40.64,50.29 16.51,50.29 10.92,44.7 10.92,40.89 v10.41,40.39
  pour Top (isolate 0.305, no thermals): 9.4,38.61 9.4,43.18 11.43,43.18 11.43,38.61
3VSWOUT
  Top 0.254: 5.85,45.72 U4.3 | 5.85,45.72 5.84,45.72 | U4.2 6.35,45.72 | 6.35,45.72 | U4.1 6.85,45.71 6.86,45.72 | 6.35,45.72 5.85,45.72
  pour Top (isolate 0.305, no thermals): 11.68,44.96 7.37,44.96 7.37,45.59 5.72,45.59 5.72,46.23 11.68,46.23
5V  (via drill 0.51)
  Top 0.508: C14.1 7.86,40.78
  Bottom 2.032: J3.2 41.66,53.85 40.89,53.09 15.49,53.09 8.13,45.72 v8.13,41.91
  pour Top (isolate 0.305, no thermals): 5.84,40.39 8.89,40.39 8.89,42.93 7.37,42.93 7.37,42.42 5.84,42.42
!RF_RESET  (via drill 0.2)
  Top 0.203: U3.18 11.41,31.13 11.68,30.86 12.19,30.86 13.08,31.75 13.08,33.02 14.73,34.67 23.11,34.67 v23.75,34.04 | v23.75,43.31 23.75,53.66 U1.44 24.11,56.79 23.24,57.66 J1.4
  Bottom 0.203: v23.75,34.04 v23.75,43.31
!RST  (via drill 0.2)
  Top 0.203: J4.3 8.45,21.53 8.45,18.03 | 8.45,18.03 6.99,18.03 4.95,20.07 4.32,20.07 3.56,20.83 3.56,22.78 S1.2 0.76,25.58 0.76,31.75 1.02,32 3.05,32 3.66,32.61 5.1,32.61 U3.4 | v9.91,17.02 9.59,17.02 8.45,18.03
  Bottom 0.203: J3.20 35.31,11.68 33.78,13.21 13.72,13.21 v9.91,17.02
DBG_GPIO1  (via drill 0.2)
  Top 0.203: R2.2 24.82,7.04 v24.89,7.11 | U3.14 8.37,29.35 8.89,28.83 26.54,28.83 v26.92,29.21 | v30.23,10.29 34.04,10.29 34.93,11.18 v34.93,16.13
  Bottom 0.203: v24.89,7.11 25.15,7.37 J3.16 v30.23,10.29 | v34.93,16.13 26.92,24.13 v26.92,29.21
DBG_GPIO2  (via drill 0.2)
  Top 0.203: U3.15 8.87,29.48 9.14,29.21 25.65,29.21 26.04,29.59 v26.04,29.72 | v34.04,15.62 v34.04,11.81 33.15,10.92 12.57,10.92 10.92,9.27 R3.2
  Bottom 0.203: 35.31,1.02 J3.19 35.31,4.06 34.04,5.33 v34.04,11.81 | v26.04,29.72 26.04,23.62 v34.04,15.62
DBG_RX  (via drill 0.2)
  Top 0.203: U3.9 5.87,28.86 v5.72,28.7 | v32.77,11.81 v32.77,15.62
  Route15 0.203: v5.72,28.7 5.72,28.32 5.97,28.07 20.32,28.07 v32.77,15.62
  Bottom 0.203: J3.18 v32.77,11.81
DBG_TX  (via drill 0.2)
  Top 0.203: 5.1,30.61 U3.8 5.11,30.63 5.08,29.97 v5.08,27.94 | v31.5,11.81 v31.5,15.37
  Route15 0.203: v5.08,27.94 5.21,27.94 5.46,27.69 19.18,27.69 v31.5,15.37
  Bottom 0.203: J3.17 32.77,3.81 31.5,5.08 v31.5,11.81
GND  (via drill 0.2, 0.3, 2.95 pad 6.35)
  Top 0.203: J4.5 10.41,22.48 11.05,23.11 13.59,23.11 | S1.1 2.59,20.91
  other vias: 6.1,43.69 13.08,62.23 54.99,62.23 6.48,33.53 7.62,33.53 8.76,33.53 7.62,32.38 7.62,31.24 6.48,32.38 6.48,31.24 8.76,32.38 8.76,31.24 2.03,19.69 14.35,22.1 13.46,31.12 1.52,33.91 1.4,28.83 37.24,18.75 35.79,19.71 37.19,22.12 40.61,23.39 44.68,23.39 49,23.39 55.09,23.52 58.78,25.17 59.28,28.22 59.28,30.38 59.28,32.92 59.28,35.08 60.81,33.93 60.81,33.3 61.57,29.36 61.06,28.35 62.2,29.11 63.47,28.98 63.47,30.51 62.46,30.89 62.84,27.97 64.11,26.95 64.62,25.81 64.62,24.41 60.93,26.7 62.33,26.31 63.22,25.04 63.35,23.77 62.59,22.89 62.71,21.62 63.98,20.98 65.13,21.36 65.38,22.38 64.87,23.39 62.33,34.95 62.33,33.43 62.33,32.16 62.33,35.97 63.6,35.97 63.6,37.87 62.59,37.87 59.28,37.24 59.28,38.63 59.66,42.06 60.55,43.46 61.95,44.09 63.47,44.22 63.47,42.7 62.46,42.57 61.57,42.19 61.06,41.17 61.06,39.27 38.25,20.52 40.54,21.79 44.73,21.79 49.05,21.79 55.27,21.79 59.97,23.83 59.28,40.41 2.67,29.46 35.28,17.42 37.24,16.71 37.24,13.92 60.81,32.66 60.81,30.38 61.06,29.87
  pour Top (isolate 0.152, rank 2, no thermals): -2.29,74.93 80.26,74.93 80.26,-10.16 -2.29,-10.16
  pour Bottom (isolate 0.152, rank 2, no thermals): -2.54,74.17 78.99,74.17 78.99,-7.62 -2.54,-7.62
  pour Route15 (isolate 0.508, rank 2): -2.41,76.83 83.69,76.83 83.69,-12.83 -2.41,-12.83
  pour Route2 (isolate 0.508, rank 2): -2.79,77.22 83.31,77.22 83.31,-12.45 -2.79,-12.45
MOD_IN  (via drill 0.2)
  Top 0.203: J3.10 31.5,38.35 30.48,37.34 v29.97,37.34 | 7.87,34.89 U3.28 7.87,36.32 8.64,37.08 26.8,37.08 v27.05,37.34
  Bottom 0.203: v29.97,37.34 v27.05,37.34
MOD_OUT  (via drill 0.2)
  Top 0.203: J3.8 34.42,59.31 34.42,38.23 32.77,36.58 v29.97,36.58 | 8.89,34.88 U3.26 8.87,35.29 10.16,36.58 v27.05,36.58
  Bottom 0.203: v29.97,36.58 v27.05,36.58
N$1
  Top 0.335: R1.1 arc-90 R1.1 60.2,27.18
  Top 0.361: U1.17 36.24,17.95 arc-90 40.89,22.61 55.63,22.61 arc90 60.2,27.18 | R1.1 C3.1
N$2
  Top 0.203: 60.2,35.01 U2.1
  Top 0.361: C3.2 60.2,35.01
N$3
  Top 0.203: 61.4,34.99 61.4,35.32 U2.4
  Top 0.335: 61.39,31.95 arc90 C6.1
  Top 0.361: 61.39,31.95 61.4,34.99
N$4
  Top 0.361: C6.2 arc90 62.76,29.72 A1.SIG
N$5
  Top 0.203: U2.5 arc-90 61.57,36.83
  Top 0.361: 61.57,36.83 C4.2
N$6
  Top 0.361: C4.1 A2.SIG
N$7
  Top 0.203: U2.8 arc-90 60.17,36.8
  Top 0.361: 60.17,36.8 C5.1
N$8
  Top 0.361: C5.2 arc-90 62.81,43.43 A3.SIG
N$9
  Top 0.203: C2.1 2.79,35.74 X1.A 2.84,34.8 3.56,34.8 4.74,33.61 5.1,33.61 U3.2
N$10
  Top 0.203: C1.1 2.81,32.86 2.79,33.13 X1.B 2.84,33.78 3.56,33.78 4.23,33.11 5.1,33.11 U3.3
N$11
  Top 0.203: U3.31 6.37,36.27 6.41,36.31 6.22,36.49 R4.2
N$12
  Top 0.203: D1.A R2.1
N$14
  Top 0.361: R1.2 arc-90 64.01,24.33 ADBG.1
N$34
  Top 0.254: U4.9 5.33,42.26 5.33,41.91 4.57,41.15 C7.2 2.79,41.15
N$36
  Top 0.254: R5.1 5.35,46.23 U4.4
N$37
  Top 0.203: U4.5 2.69,44.44 R9.1 R8.2
PPS  (via drill 0.2)
  Top 0.203: v3.68,31.12 4.18,31.61 5.1,31.61 U3.6 | v35.18,44.96 35.18,45.21 34.93,45.47 34.93,58.04 35.31,58.42 35.31,60.96 J3.7
  Bottom 0.203: v3.68,31.12 3.68,34.16 6.6,37.08 11.43,37.08 12.57,38.23 12.57,44.07 13.46,44.96 v35.18,44.96
R3
  Top 0.203: D2.A R3.1
RF_ANT1  (via drill 0.2)
  Top 0.152: v60.81,34.52 60.99,34.7 U2.3
  Top 0.203: U3.10 6.37,29.06 8.13,27.3 30.73,27.3 38.23,34.8 v54.61,34.8 | v50.42,47.12 51.56,47.12 52.7,48.26 52.7,55.37 53.21,55.88 54.86,55.88 J2.4
  Bottom 0.152: 57.28,34.8 58.23,35.75 60.83,35.75 60.96,35.62 60.96,34.67 v60.81,34.52
  Bottom 0.203: 57.28,34.8 v54.61,34.8 50.93,34.8 50.42,35.31 v50.42,47.12
RF_ANT2  (via drill 0.2)
  Top 0.152: v61.6,37.85 60.99,37.24 U2.6
  Top 0.203: U3.11 6.87,29.07 8.25,27.69 30.61,27.69 38.99,36.07 v54.61,36.07 | v51.18,48.39 51.18,51.44 52.2,52.45 52.2,55.75 J2.3
  Bottom 0.152: v54.61,36.07 60.83,36.07 60.96,36.2 60.96,37.21 v61.6,37.85
  Bottom 0.203: v54.61,36.07 51.82,36.07 51.18,36.7 v51.18,48.39
RF_ANT3  (via drill 0.2)
  Top 0.152: v60.83,38.23 60.59,37.99 U2.7
  Top 0.203: U3.12 7.37,29.08 8.38,28.07 30.48,28.07 39.75,37.34 49.66,37.34 | 49.66,37.34 v54.61,37.34 | J2.2 51.51,57.23 49.66,55.37 49.66,37.34
  Bottom 0.152: 57.28,37.34 58.23,36.38 60.45,36.38 60.58,36.51 60.58,37.97 v60.83,38.23
  Bottom 0.203: v54.61,37.34 57.28,37.34
RF_GPIO2  (via drill 0.2)
  Top 0.203: v11.18,35.81 10.36,35.81 9.43,34.88 U3.25 | v13.21,43.43 14.13,44.36 U1.3 | v13.21,43.43 13.21,46.61 11.38,48.44 11.38,57.61 J1.1 | R7.1 12.7,40.64 13.21,41.15 v13.21,43.43
  Bottom 0.203: v11.18,35.81 13.21,37.85 v13.21,43.43
RF_GPIO3  (via drill 0.2)
  Top 0.203: 5.1,31.11 U3.7 4.72,31.13 4.45,30.86 4.45,28.45 v4.32,28.32 | v24.51,30.35 29.21,30.35 37.59,38.73 42.42,38.73 45.09,41.4 45.09,54 U1.37 45.21,54.18 45.21,55.75 47.12,57.66 48.92,57.66 J2.1 | R6.1 v16,30.23
  Bottom 0.203: v4.32,28.32 4.45,28.32 5.46,29.34 16,29.34 | 16,29.34 23.37,29.34 24.26,30.23 24.38,30.23 v24.51,30.35 | v16,30.23 16,29.34
RF_RX  (via drill 0.2)
  Top 0.203: U3.29 7.37,36.83 8.13,37.59 13.46,37.59 13.72,37.85 13.72,39.12 14.22,39.62 18.41,39.62 | 18.41,39.62 v26.92,39.62 | v35.43,39.62 40.51,39.62 42.42,41.53 42.42,53.98 U1.38 | v18.41,43.18 18.8,43.56 18.8,50.16 13.92,55.04 13.92,57.61 J1.2 | v18.41,38.48 18.41,39.62
  Bottom 0.203: v26.92,39.62 v35.43,39.62 | v18.41,43.18 v18.41,38.48
RF_TX  (via drill 0.2)
  Top 0.203: U3.30 6.87,37.1 7.87,38.1 12.95,38.1 13.21,38.35 13.21,39.62 13.72,40.13 19.43,40.13 | v26.92,40.64 26.42,40.13 19.43,40.13 | v35.43,40.64 37.97,40.64 39.37,42.04 39.37,54.03 U1.39 | 19.43,40.13 19.43,50.55 16.46,53.52 16.46,57.61 J1.3
  Bottom 0.203: v26.92,40.64 v35.43,40.64
SCL  (via drill 0.2)
  Top 0.203: U3.13 7.87,29.21 8.64,28.45 28.96,28.45 v38.35,37.85 | v38.35,43.18 38.35,44.58 37.85,45.09 37.85,60.96 J3.5 | 11.8,31.63 v11.94,31.5 11.8,31.63 | U3.19 11.8,31.63
  Bottom 0.203: v38.35,37.85 v38.35,43.18 | 32.26,31.75 v38.35,37.85 | v11.94,31.5 12.19,31.75 32.26,31.75 | 32.26,31.75 v38.35,37.85
SDA  (via drill 0.2)
  Top 0.203: v8.89,36.32 8.89,36.27 8.37,35.76 U3.27 | U3.20 12.07,32.13 v12.32,32.38 | v37.34,44.32 37.34,58.93 J3.6
  Bottom 0.203: v8.89,36.32 10.03,35.18 11.81,35.18 | 11.81,35.18 13.97,37.34 13.97,42.67 15.49,44.2 37.34,44.2 v37.34,44.32 | v12.32,32.38 12.32,34.67 11.81,35.18
SWDCLK  (via drill 0.2)
  Top 0.203: J4.4 8.45,24.7 8.45,26.48 7.62,27.3 v3.68,27.3 v3.68,30.23 | U3.24 10.51,34.13 v10.92,34.54
  Route15 0.203: v19.94,19.43 12.07,27.3 v3.68,27.3
  Bottom 0.203: v3.68,30.23 4.45,30.99 4.45,34.29 5.46,35.31 9.14,35.31 9.91,34.54 v10.92,34.54 | J3.21 37.85,3.81 39.24,5.21 39.24,10.03 34.93,14.35 25.02,14.35 v19.94,19.43
SWDIO  (via drill 0.2)
  Top 0.203: J4.2 7.81,24.07 5.4,24.07 3.81,25.65 | U3.23 11.16,33.63 v11.43,33.91 | v2.67,28.57 2.67,26.8 3.81,25.65 | v4.19,26.04 3.81,25.65
  Route15 0.203: v12.19,18.03 6.99,18.03 4.32,20.7 v4.32,21.21
  Bottom 0.203: v11.43,33.91 11.18,33.66 10.16,33.66 8.89,34.93 5.59,34.93 4.83,34.16 4.83,29.97 4.19,29.34 3.43,29.34 v2.67,28.57 | J3.22 37.85,10.41 34.54,13.72 16.51,13.72 v12.19,18.03 | v4.19,26.04 3.56,25.4 3.56,21.97 v4.32,21.21
USB+
  Top 0.203: J3.11 27.81,61.09 27.81,56.26 28.57,55.5 28.57,36.7 27.43,35.56 13.97,35.56 11.55,33.13 U3.22
USB-
  Top 0.203: J3.12 28.96,48.33 arc90 29.25,48.04 29.34,48.04 arc-90 29.63,47.75 29.63,47.01 arc-90 29.34,46.72 29.25,46.72 arc90 28.96,46.43 28.96,45.69 arc90 29.25,45.4 29.34,45.4 arc-90 29.63,45.11 29.63,44.37 arc-90 29.34,44.08 29.25,44.08 arc90 28.96,43.79 28.96,43.05 arc90 29.25,42.76 29.34,42.76 arc-90 29.63,42.47 29.63,41.73 arc-90 29.34,41.44 29.25,41.44 arc90 28.96,41.15 28.96,36.45 27.69,35.18 14.22,35.18 11.68,32.63 U3.21

### Text on the board
tPlace: VBUS | USB+ | PPS | SCL | GND | RF DBG | RF DBG | GND | USB- | IN | OUT | SDA | VCCIO | 5V | GPIO2 | RX | TX | !RST | GPIO3 | A3 | A2 | A1 | STM32 PROG | -ADBG_EN | RESET | A | RF / Spectrum / Sensor
tNames: Joshua / Adkins | 5/2017